# EAGLE design RN-42-Carrier-Board (EAGLE 5.11)
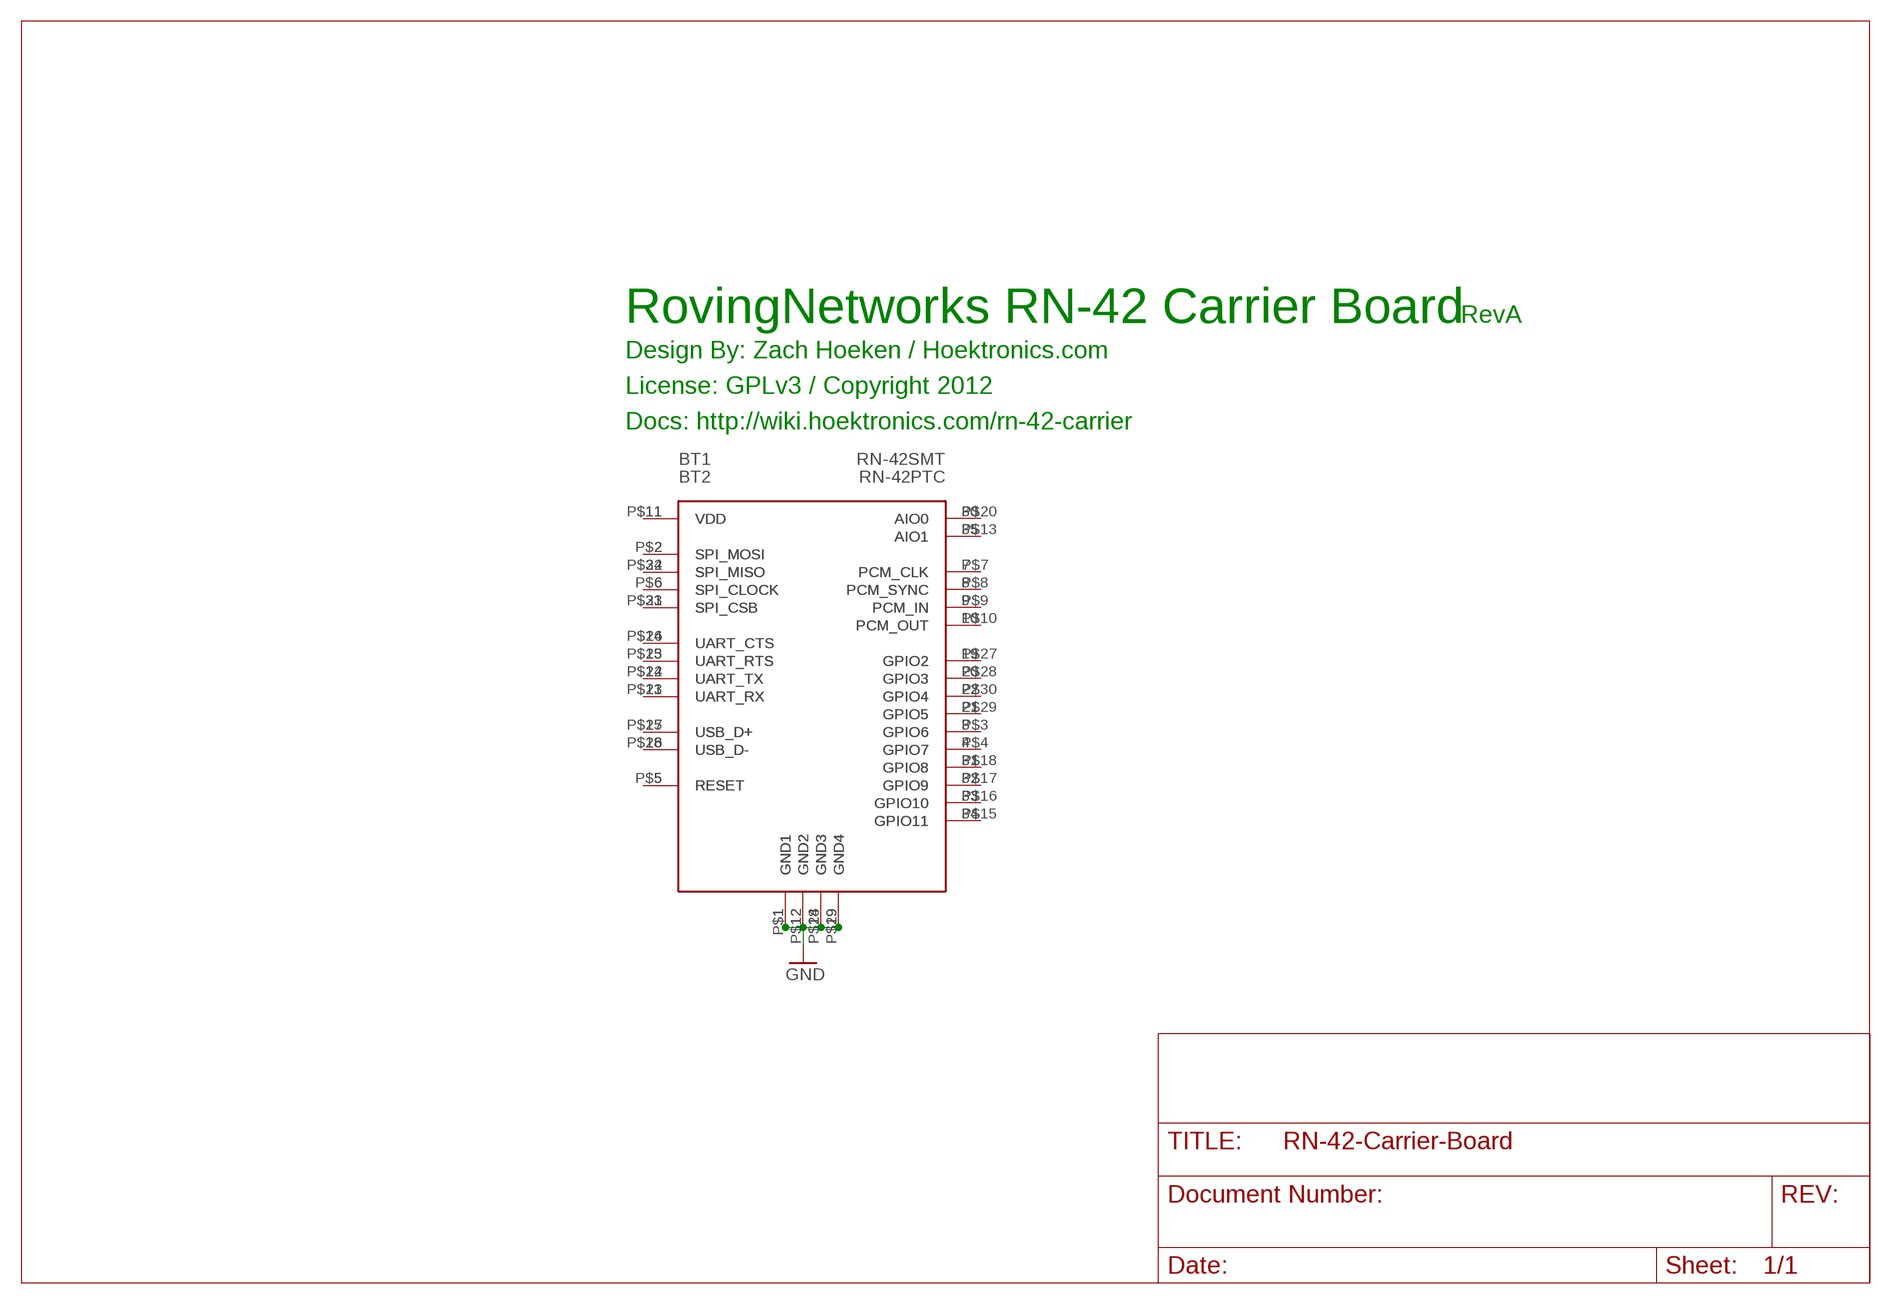
[diagram p0: schematic, sheet 1]

## Parts
BT1  RN-42SMT  [RN-42]
BT2  RN-42PTC  [RN-42-CARRIER]

## Nets
GND: BT1.1(GND1) BT1.12(GND2) BT1.28(GND3) BT1.29(GND4) BT2.P$1(GND1) BT2.P$12(GND2) BT2.P$14(GND3) BT2.P$19(GND4)
N$5: BT1.2(SPI_MOSI) BT2.P$2(SPI_MOSI)
N$6: BT1.24(SPI_MISO) BT2.P$32(SPI_MISO)
N$7: BT1.6(SPI_CLOCK) BT2.P$6(SPI_CLOCK)
N$8: BT1.23(SPI_CSB) BT2.P$31(SPI_CSB)
N$9: BT1.16(UART_CTS) BT2.P$24(UART_CTS)
N$10: BT1.15(UART_RTS) BT2.P$23(UART_RTS)
N$11: BT1.14(UART_TX) BT2.P$22(UART_TX)
N$12: BT1.13(UART_RX) BT2.P$21(UART_RX)
N$13: BT1.17(USB_D+) BT2.P$25(USB_D+)
N$14: BT1.18(USB_D-) BT2.P$26(USB_D-)
N$15: BT1.30(AIO0) BT2.P$20(AIO0)
N$16: BT1.35(AIO1) BT2.P$13(AIO1)
N$17: BT1.7(PCM_CLK) BT2.P$7(PCM_CLK)
N$18: BT1.8(PCM_SYNC) BT2.P$8(PCM_SYNC)
N$19: BT1.9(PCM_IN) BT2.P$9(PCM_IN)
N$20: BT1.10(PCM_OUT) BT2.P$10(PCM_OUT)
N$21: BT1.5(RESET) BT2.P$5(RESET)
N$22: BT1.11(VDD) BT2.P$11(VDD)
N$23: BT1.19(GPIO2) BT2.P$27(GPIO2)
N$24: BT1.20(GPIO3) BT2.P$28(GPIO3)
N$25: BT1.22(GPIO4) BT2.P$30(GPIO4)
N$26: BT1.21(GPIO5) BT2.P$29(GPIO5)
N$27: BT1.3(GPIO6) BT2.P$3(GPIO6)
N$28: BT1.4(GPIO7) BT2.P$4(GPIO7)
N$29: BT1.31(GPIO8) BT2.P$18(GPIO8)
N$30: BT1.32(GPIO9) BT2.P$17(GPIO9)
N$31: BT1.33(GPIO10) BT2.P$16(GPIO10)
N$32: BT1.34(GPIO11) BT2.P$15(GPIO11)

## Notes on the sheet
- RovingNetworks RN-42 Carrier Board | RevA
- Design By: Zach Hoeken / Hoektronics.com
- License: GPLv3 / Copyright 2012
- Docs: http://wiki.hoektronics.com/rn-42-carrier

## Library data of the parts
BT1 BT2 = Hoektronics:RN-42

## Board
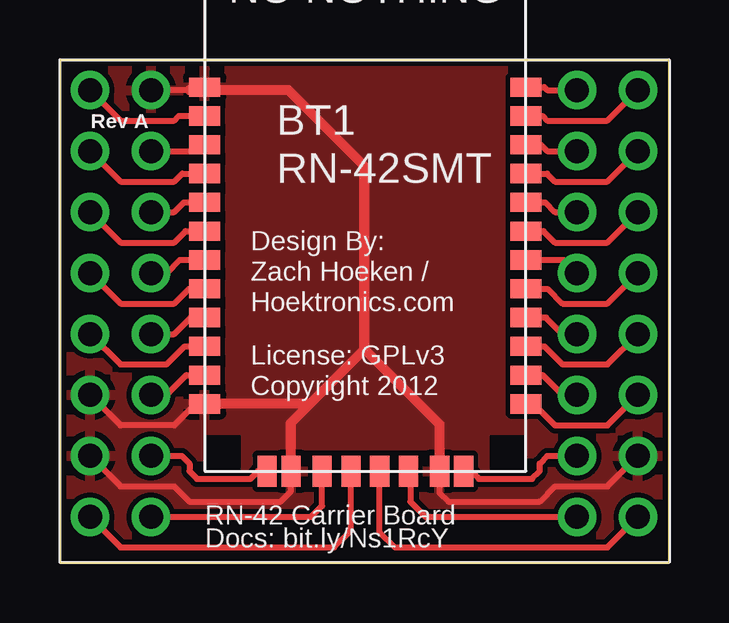
[diagram p1: board, top side]

Size 25.38 x 20.94 mm. Coordinates in mm from the lower left corner, seen from the top.
Outline: 0,0 25.38,0 25.38,20.94 0,20.94 0,0
Copper layers (1*16): Top 0.035mm / dielectric 1.5mm / Bottom 0.035mm
Design rules "hoektronics": minimum track width 8mil, minimum drill 20mil, track to track 8mil, track to pad 8mil, pad to pad 8mil, via to via 8mil, smd to smd 8mil, copper to edge 10mil, drill to drill 8mil, minimum pad ring 12mil, minimum via ring 10mil, stop-mask expansion 4mil, vias tented up to drill 25mil, thermal gap 10mil

### Footprints (pad centres in the part's own frame; a part is rotated, then mirrored left to right if it is on the bottom)
RN-42 = smd 1.3 x 0.8: 1 0,16; 2 0,14.8; 3 0,13.6; 4 0,12.4; 5 0,11.2; 6 0,10; 7 0,8.8; 8 0,7.6; 9 0,6.4; 10 0,5.2; 11 0,4; 12 0,2.8; 13 13.4,2.8; 14 13.4,4; 15 13.4,5.2; 16 13.4,6.4; 17 13.4,7.6; 18 13.4,8.8; 19 13.4,10; 20 13.4,11.2; 21 13.4,12.4; 22 13.4,13.6; 23 13.4,14.8; 24 13.4,16 | smd 0.8 x 1.3: 28 9.8,0; 29 3.6,0; 30 10.8,0; 31 8.5,0; 32 7.3,0; 33 6.1,0; 34 4.9,0; 35 2.6,0
RN-42-CARRIER = drill 1 round: P$1 -2.237,15.875; P$2 -4.777,15.875; P$3 -2.237,13.335; P$4 -4.777,13.335; P$5 -2.237,10.795; P$6 -4.777,10.795; P$7 -2.237,8.255; P$8 -4.777,8.255; P$9 -2.237,5.715; P$10 -4.777,5.715; P$11 -2.237,3.175; P$12 -4.777,3.175; P$13 -2.237,0.635; P$14 -4.777,0.635; P$15 -2.237,-1.905; P$16 -4.777,-1.905; P$17 18.067,-1.905; P$18 15.527,-1.905; P$19 18.067,0.635; P$20 15.527,0.635; P$21 18.067,3.175; P$22 15.527,3.175; P$23 18.067,5.715; P$24 15.527,5.715; P$25 18.067,8.255; P$26 15.527,8.255; P$27 18.067,10.795; P$28 15.527,10.795; P$29 18.067,13.335; P$30 15.527,13.335; P$31 18.067,15.875; P$32 15.527,15.875

### Placement (x,y rotation side)
BT1  6.03,3.81 0 top
BT2  6.03,3.81 0 top

### Tracks (layer width: path | path; a pad name or v marks a point on that pad's centre or on a via)
GND
  Top 0.254: BT1.1 5.52,19.81 5.4,19.68 BT2.P$1 | BT1.12 5.66,6.61 4.76,5.71 2.52,5.71 BT2.P$12 | BT2.P$14 2.52,3.17 4.76,3.17 5.4,2.54 9.21,2.54 9.63,2.96 BT1.29 | BT2.P$19 22.83,3.17 20.64,3.17 20,2.54 16.19,2.54 15.83,2.9 BT1.28
  Top 0.406: 5.4,19.68 9.53,19.68 12.7,16.51 12.7,8.89 | 10.42,6.61 5.66,6.61 | 10.42,6.61 12.7,8.89 | BT1.28 15.83,5.76 12.7,8.89 | BT1.29 9.63,5.82 10.42,6.61
  pour Top: -0.64,21.59 26.04,21.59 26.04,-0.64 -0.64,-0.64
N$5
  Top 0.254: BT1.2 4.96,18.61 4.76,18.41 2.52,18.41 BT2.P$2
N$6
  Top 0.254: BT1.24 20.2,19.81 20.32,19.68 BT2.P$32
N$7
  Top 0.254: BT1.6 5.24,13.81 4.76,13.34 2.52,13.34 BT2.P$6
N$8
  Top 0.254: BT1.23 20.12,18.61 20.32,18.41 22.83,18.41 BT2.P$31
N$9
  Top 0.254: BT1.16 20.27,10.21 20.95,9.53 BT2.P$24
N$10
  Top 0.254: BT1.15 20.2,9.01 20.95,8.26 22.83,8.26 BT2.P$23
N$11
  Top 0.254: BT1.14 20.13,7.81 20.95,6.99 BT2.P$22
N$12
  Top 0.254: BT1.13 19.74,6.61 20.64,5.71 22.83,5.71 BT2.P$21
N$13
  Top 0.254: BT1.17 20.34,11.41 20.95,10.79 22.83,10.79 BT2.P$25
N$14
  Top 0.254: BT1.18 21.02,12.61 BT2.P$26
N$15
  Top 0.254: BT1.30 17.14,3.81 17.46,3.49 19.68,3.49 20,3.81 20,4.13 20.32,4.45 BT2.P$20
N$16
  Top 0.254: BT1.35 8.26,3.81 7.94,3.49 5.71,3.49 5.4,3.81 5.4,4.13 5.08,4.45 BT2.P$13
N$17
  Top 0.254: BT1.7 4.99,12.61 4.45,12.06 BT2.P$7
N$18
  Top 0.254: BT1.8 5.38,11.41 4.76,10.79 2.52,10.79 BT2.P$8
N$19
  Top 0.254: BT1.9 5.45,10.21 4.76,9.53 BT2.P$9
N$20
  Top 0.254: BT1.10 5.2,9.01 4.45,8.26 2.52,8.26 BT2.P$10
N$21
  Top 0.254: BT1.5 5.17,15.01 4.76,14.61 BT2.P$5
N$22
  Top 0.254: BT1.11 5.27,7.81 4.45,6.99 BT2.P$11
N$23
  Top 0.254: BT1.19 20.16,13.81 20.64,13.34 22.83,13.34 BT2.P$27
N$24
  Top 0.254: BT1.20 20.23,15.01 20.64,14.61 BT2.P$28
N$25
  Top 0.254: BT1.22 20.05,17.41 20.32,17.14 BT2.P$30
N$26
  Top 0.254: BT1.21 20.3,16.21 20.64,15.88 22.83,15.88 BT2.P$29
N$27
  Top 0.254: BT1.3 5.66,17.41 5.4,17.14 BT2.P$3
N$28
  Top 0.254: BT1.4 5.1,16.21 4.76,15.88 2.52,15.88 BT2.P$4
N$29
  Top 0.254: BT2.P$18 15.24,1.91 14.61,2.54 14.61,3.74 BT1.31
N$30
  Top 0.254: BT1.32 13.33,1.27 13.97,0.64 22.83,0.64 BT2.P$17
N$31
  Top 0.254: BT1.33 12.13,1.34 11.43,0.64 2.52,0.64 BT2.P$16
N$32
  Top 0.254: BT1.34 10.93,2.36 10.48,1.91 BT2.P$15

### Text on the board
tPlace: Rev A | Design By: | Zach Hoeken / | Hoektronics.com | License: GPLv3 | Copyright 2012 | RN-42 Carrier Board | Docs: bit.ly/Ns1RcY